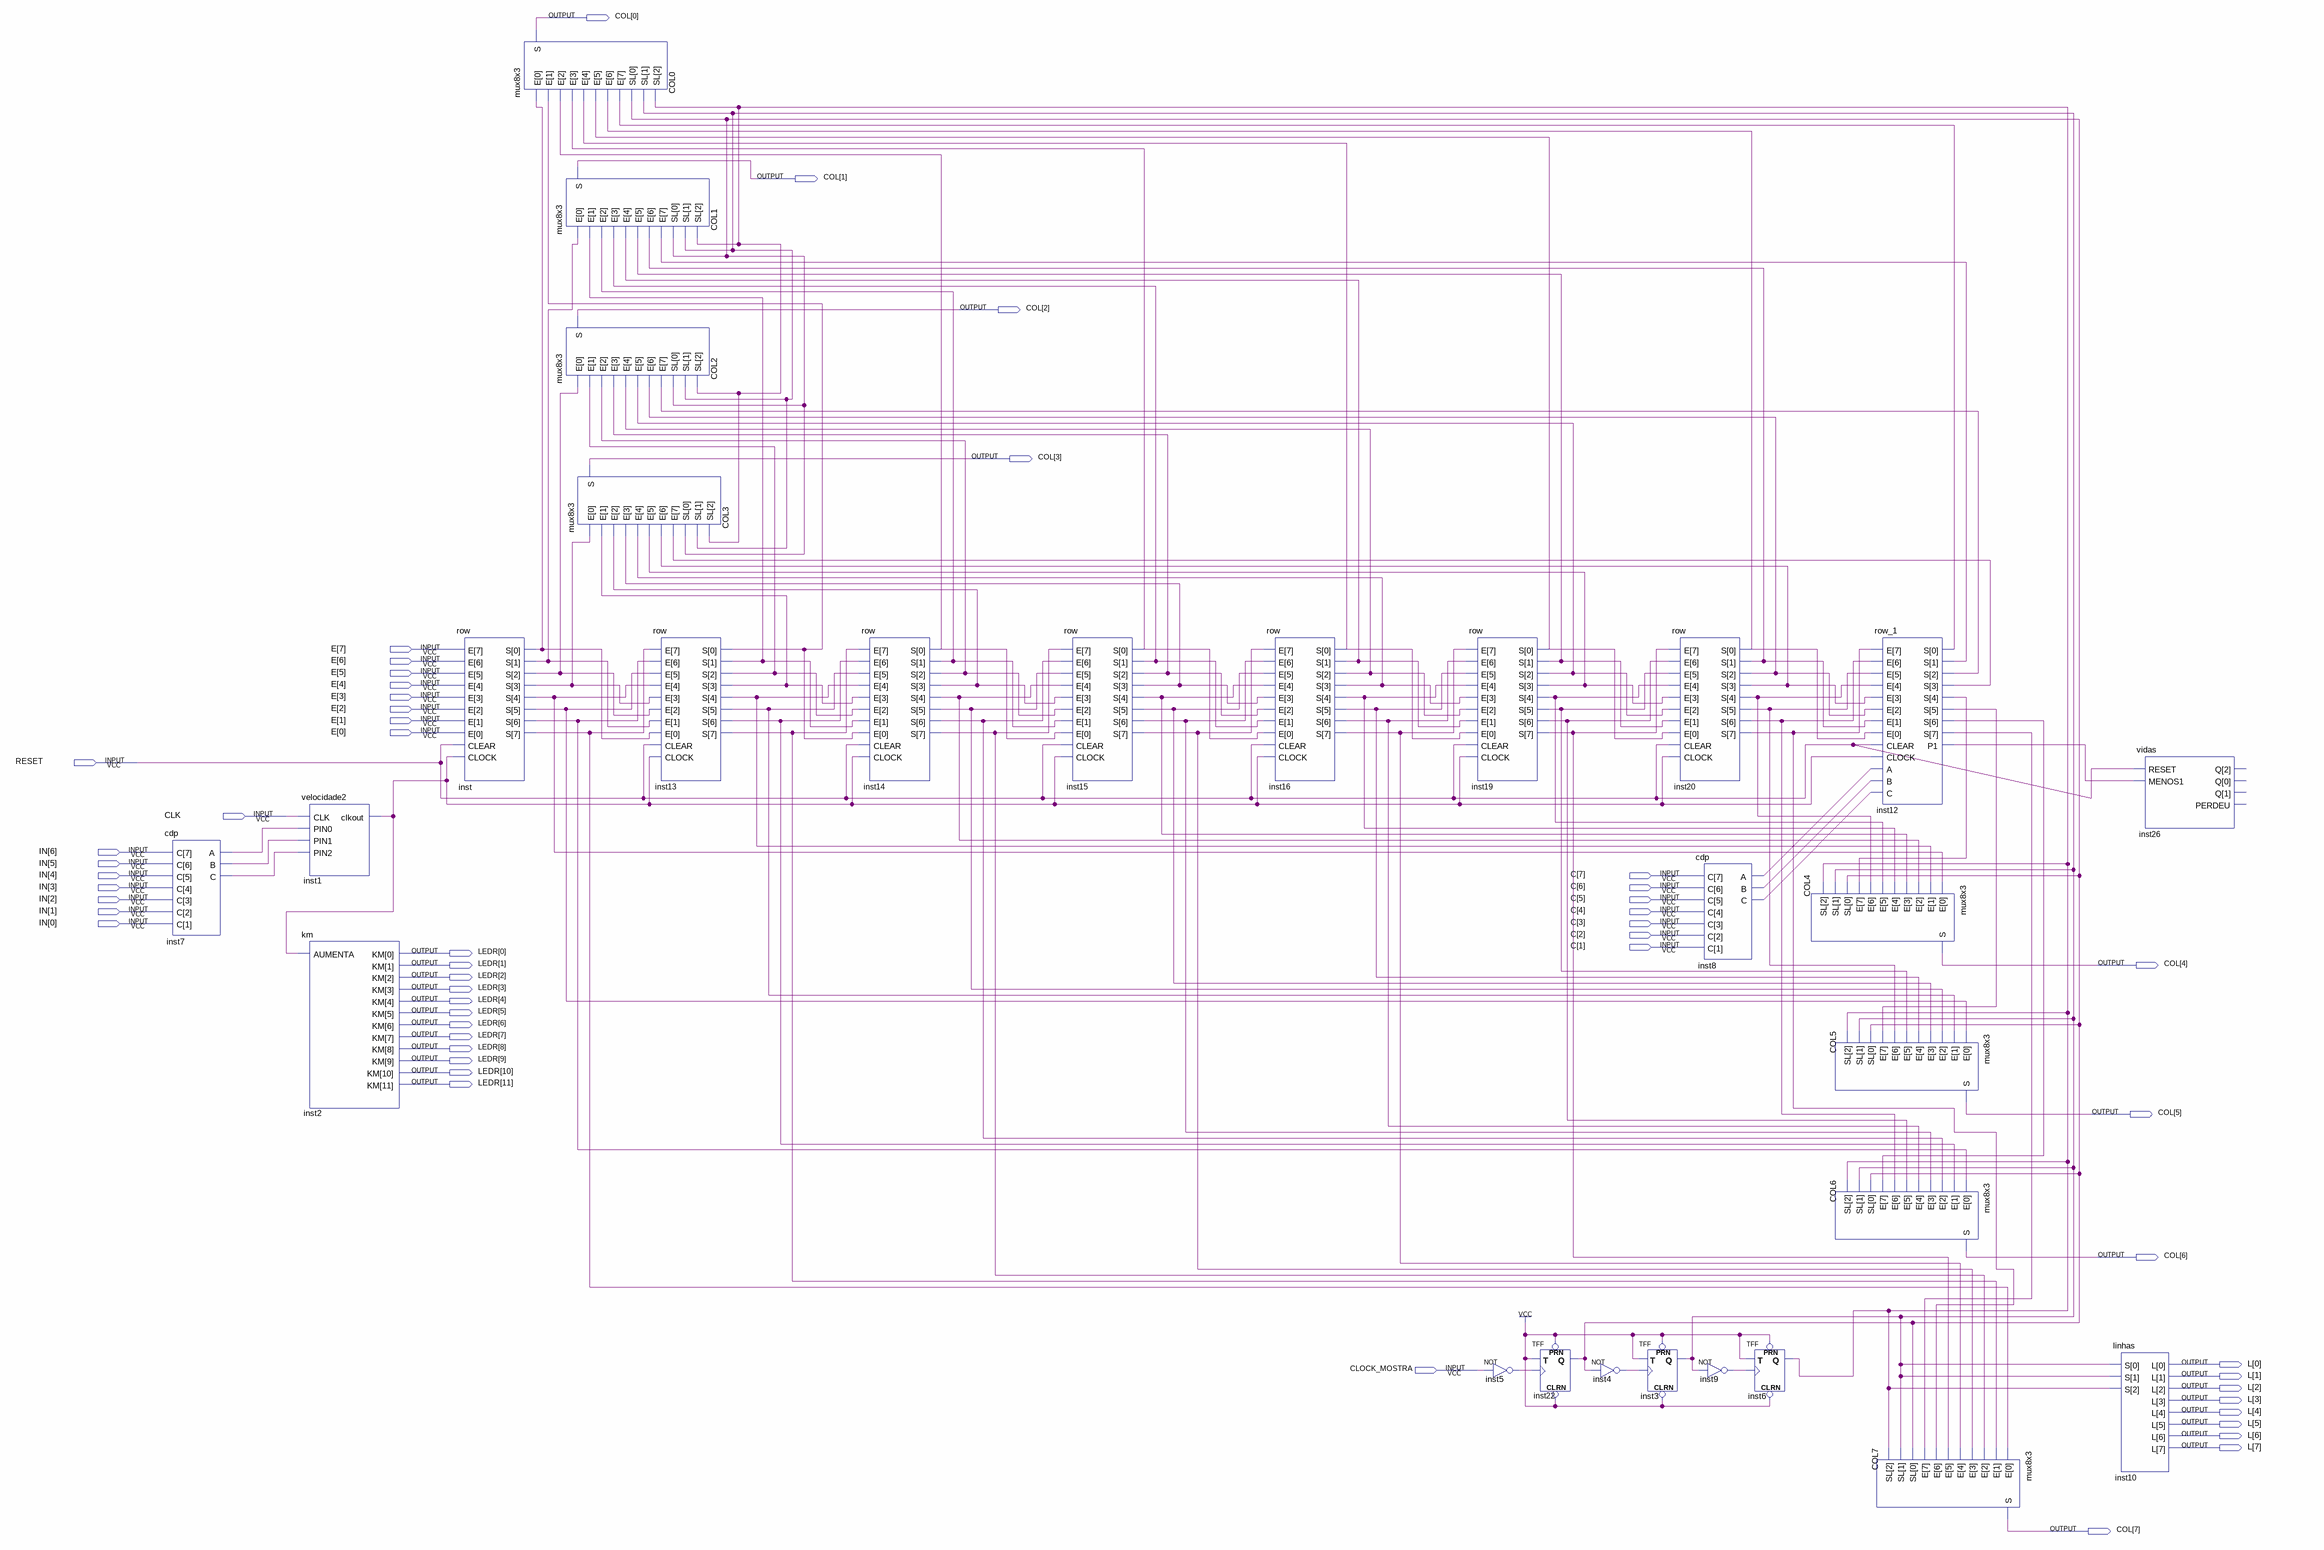
[diagram p0: schematic sheet]
// Quartus schematic interface.bdf as structural Verilog: 28 symbols, 53 pins
module \interface  (
  input  [7:0] E,
  input  RESET,
  input  CLK,
  input  [6:0] IN,
  input  [7:1] C,
  input  CLOCK_MOSTRA,
  output [7:0] COL,
  output [11:0] LEDR,
  output [7:0] L
);

  wire inst1_clkout, inst3_q, inst4_out, inst5_out, inst6_q, inst7_a, inst7_b, inst7_c, inst8_a, inst8_b,
       inst8_c, inst9_out, inst12_p1, inst12_s, inst12_s_2, inst12_s_3, inst12_s_4, inst12_s_5, inst12_s_6,
       inst12_s_7, inst12_s_8, inst13_s, inst13_s_2, inst13_s_3, inst13_s_4, inst13_s_5, inst13_s_6,
       inst13_s_7, inst13_s_8, inst14_s, inst14_s_2, inst14_s_3, inst14_s_4, inst14_s_5, inst14_s_6,
       inst14_s_7, inst14_s_8, inst15_s, inst15_s_2, inst15_s_3, inst15_s_4, inst15_s_5, inst15_s_6,
       inst15_s_7, inst15_s_8, inst16_s, inst16_s_2, inst16_s_3, inst16_s_4, inst16_s_5, inst16_s_6,
       inst16_s_7, inst16_s_8, inst19_s, inst19_s_2, inst19_s_3, inst19_s_4, inst19_s_5, inst19_s_6,
       inst19_s_7, inst19_s_8, inst20_s, inst20_s_2, inst20_s_3, inst20_s_4, inst20_s_5, inst20_s_6,
       inst20_s_7, inst20_s_8, inst22_q, inst_s, inst_s_2, inst_s_3, inst_s_4, inst_s_5, inst_s_6, inst_s_7,
       inst_s_8;

  cdp inst7 (.C({IN, inst7_c}), .A(inst7_a), .B(inst7_b));
  velocidade2 inst1 (.CLK(CLK), .PIN0(inst7_a), .PIN1(inst7_b), .PIN2(inst7_c), .clkout(inst1_clkout));
  km inst2 (.AUMENTA(inst1_clkout), .KM(LEDR));
  row inst (
    .E(E), .CLEAR(RESET), .CLOCK(inst1_clkout),
    .S({inst_s_5, inst_s_6, inst_s_7, inst_s_8, inst_s_2, inst_s, inst_s_3, inst_s_4}));
  mux8x3 COL0 (
    .E({inst12_s, inst20_s, inst19_s, inst16_s, inst15_s, inst14_s, inst13_s_2, inst_s_4}),
    .SL({inst6_q, inst3_q, inst22_q}), .S(COL[0]));
  mux8x3 COL1 (
    .E({inst12_s_2, inst20_s_2, inst19_s_2, inst16_s_2, inst15_s_2, inst14_s_2, inst13_s, inst_s_3}),
    .SL({inst6_q, inst3_q, inst22_q}), .S(COL[1]));
  mux8x3 COL2 (
    .E({inst12_s_3, inst20_s_3, inst19_s_3, inst16_s_3, inst15_s_3, inst14_s_3, inst13_s_3, inst_s}),
    .SL({inst6_q, inst3_q, inst22_q}), .S(COL[2]));
  mux8x3 COL3 (
    .E({inst12_s_4, inst20_s_4, inst19_s_4, inst16_s_4, inst15_s_4, inst14_s_4, inst13_s_4, inst_s_2}),
    .SL({inst6_q, inst3_q, inst22_q}), .S(COL[3]));
  row inst13 (
    .E({inst_s_5, inst_s_6, inst_s_7, inst_s_8, inst_s_2, inst_s, inst_s_3, inst_s_4}), .CLEAR(RESET),
    .CLOCK(inst1_clkout),
    .S({inst13_s_7, inst13_s_6, inst13_s_5, inst13_s_8, inst13_s_4, inst13_s_3, inst13_s, inst13_s_2}));
  row inst14 (
    .E({inst13_s_7, inst13_s_6, inst13_s_5, inst13_s_8, inst13_s_4, inst13_s_3, inst13_s, inst13_s_2}),
    .CLEAR(RESET), .CLOCK(inst1_clkout),
    .S({inst14_s_7, inst14_s_6, inst14_s_5, inst14_s_8, inst14_s_4, inst14_s_3, inst14_s_2, inst14_s}));
  row inst15 (
    .E({inst14_s_7, inst14_s_6, inst14_s_5, inst14_s_8, inst14_s_4, inst14_s_3, inst14_s_2, inst14_s}),
    .CLEAR(RESET), .CLOCK(inst1_clkout),
    .S({inst15_s_7, inst15_s_6, inst15_s_5, inst15_s_8, inst15_s_4, inst15_s_3, inst15_s_2, inst15_s}));
  row inst16 (
    .E({inst15_s_7, inst15_s_6, inst15_s_5, inst15_s_8, inst15_s_4, inst15_s_3, inst15_s_2, inst15_s}),
    .CLEAR(RESET), .CLOCK(inst1_clkout),
    .S({inst16_s_7, inst16_s_6, inst16_s_5, inst16_s_8, inst16_s_4, inst16_s_3, inst16_s_2, inst16_s}));
  row inst19 (
    .E({inst16_s_7, inst16_s_6, inst16_s_5, inst16_s_8, inst16_s_4, inst16_s_3, inst16_s_2, inst16_s}),
    .CLEAR(RESET), .CLOCK(inst1_clkout),
    .S({inst19_s_8, inst19_s_7, inst19_s_6, inst19_s_5, inst19_s_4, inst19_s_3, inst19_s_2, inst19_s}));
  not inst5 (inst5_out, CLOCK_MOSTRA);
  TFF inst22 (.PRN(1'b1), .CLRN(1'b1), .T(1'b1), .CLK(inst5_out), .Q(inst22_q));
  not inst4 (inst4_out, inst22_q);
  TFF inst3 (.PRN(1'b1), .CLRN(1'b1), .T(1'b1), .CLK(inst4_out), .Q(inst3_q));
  row inst20 (
    .E({inst19_s_8, inst19_s_7, inst19_s_6, inst19_s_5, inst19_s_4, inst19_s_3, inst19_s_2, inst19_s}),
    .CLEAR(RESET), .CLOCK(inst1_clkout),
    .S({inst20_s_7, inst20_s_6, inst20_s_5, inst20_s_8, inst20_s_4, inst20_s_3, inst20_s_2, inst20_s}));
  cdp inst8 (.C({C, inst8_c}), .A(inst8_a), .B(inst8_b));
  not inst9 (inst9_out, inst3_q);
  TFF inst6 (.PRN(1'b1), .CLRN(1'b1), .T(1'b1), .CLK(inst9_out), .Q(inst6_q));
  mux8x3 COL4 (
    .E({inst12_s_8, inst20_s_8, inst19_s_5, inst16_s_8, inst15_s_8, inst14_s_8, inst13_s_8, inst_s_8}),
    .SL({inst6_q, inst3_q, inst22_q}), .S(COL[4]));
  mux8x3 COL5 (
    .E({inst12_s_6, inst20_s_5, inst19_s_6, inst16_s_5, inst15_s_5, inst14_s_5, inst13_s_5, inst_s_7}),
    .SL({inst6_q, inst3_q, inst22_q}), .S(COL[5]));
  mux8x3 COL6 (
    .E({inst12_s_7, inst20_s_6, inst19_s_7, inst16_s_6, inst15_s_6, inst14_s_6, inst13_s_6, inst_s_6}),
    .SL({inst6_q, inst3_q, inst22_q}), .S(COL[6]));
  row_1 inst12 (
    .E({inst20_s_7, inst20_s_6, inst20_s_5, inst20_s_8, inst20_s_4, inst20_s_3, inst20_s_2, inst20_s}),
    .CLEAR(RESET), .CLOCK(inst1_clkout), .A(inst8_a), .B(inst8_b), .C(inst8_c),
    .S({inst12_s_5, inst12_s_7, inst12_s_6, inst12_s_8, inst12_s_4, inst12_s_3, inst12_s_2, inst12_s}),
    .P1(inst12_p1));
  mux8x3 COL7 (
    .E({inst12_s_5, inst20_s_7, inst19_s_8, inst16_s_7, inst15_s_7, inst14_s_7, inst13_s_7, inst_s_5}),
    .SL({inst6_q, inst3_q, inst22_q}), .S(COL[7]));
  vidas inst26 (.RESET(RESET), .MENOS1(inst12_p1));  // open: Q, PERDEU
  linhas inst10 (.S({inst6_q, {2{inst3_q}}}), .L(L));
endmodule
